# EAGLE design collidoscope_pcb (EAGLE 7.5.0)
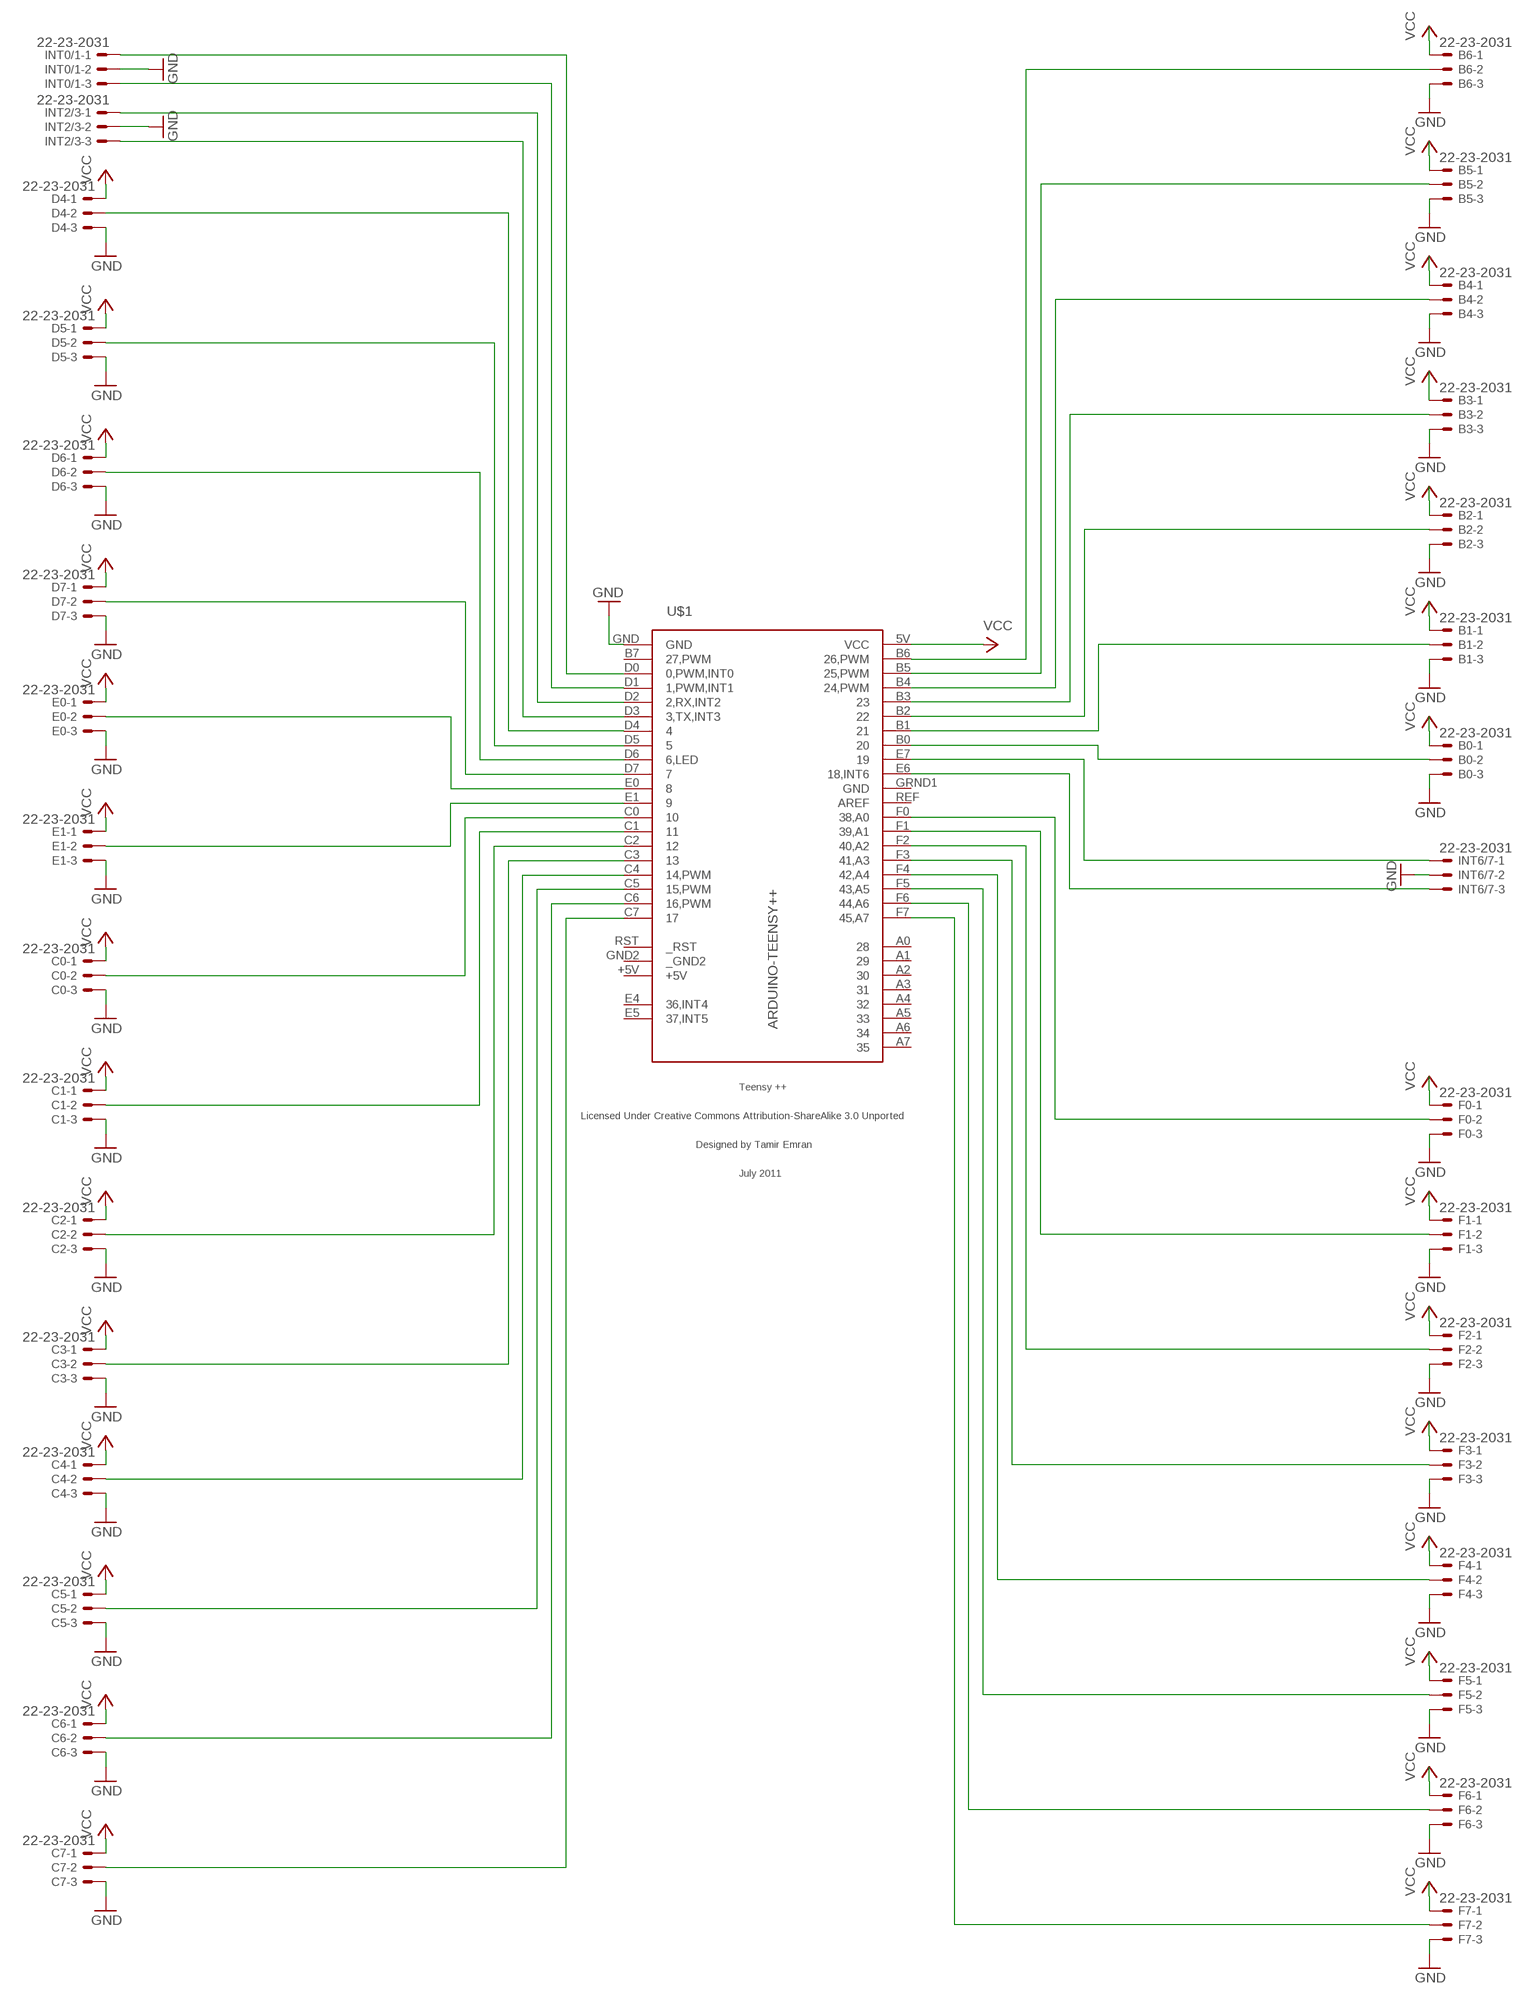
[diagram p0: schematic, sheet 1]

## Parts
B0  22-23-2031  [22-23-2031]
B1  22-23-2031  [22-23-2031]
B2  22-23-2031  [22-23-2031]
B3  22-23-2031  [22-23-2031]
B4  22-23-2031  [22-23-2031]
B5  22-23-2031  [22-23-2031]
B6  22-23-2031  [22-23-2031]
C0  22-23-2031  [22-23-2031]
C1  22-23-2031  [22-23-2031]
C2  22-23-2031  [22-23-2031]
C3  22-23-2031  [22-23-2031]
C4  22-23-2031  [22-23-2031]
C5  22-23-2031  [22-23-2031]
C6  22-23-2031  [22-23-2031]
C7  22-23-2031  [22-23-2031]
D4  22-23-2031  [22-23-2031]
D5  22-23-2031  [22-23-2031]
D6  22-23-2031  [22-23-2031]
D7  22-23-2031  [22-23-2031]
E0  22-23-2031  [22-23-2031]
E1  22-23-2031  [22-23-2031]
F0  22-23-2031  [22-23-2031]
F1  22-23-2031  [22-23-2031]
F2  22-23-2031  [22-23-2031]
F3  22-23-2031  [22-23-2031]
F4  22-23-2031  [22-23-2031]
F5  22-23-2031  [22-23-2031]
F6  22-23-2031  [22-23-2031]
F7  22-23-2031  [22-23-2031]
INT0/1  22-23-2031  [22-23-2031]
INT2/3  22-23-2031  [22-23-2031]
INT6/7  22-23-2031  [22-23-2031]
U$1  ARDUINO-TEENSY++  [TEENSY++]

## Nets
GND: B0.3 B1.3 B2.3 B3.3 B4.3 B5.3 B6.3 C0.3 C1.3 C2.3 C3.3 C4.3 C5.3 C6.3 C7.3 D4.3 D5.3 D6.3 D7.3 E0.3 E1.3 F0.3 F1.3 F2.3 F3.3 F4.3 F5.3 F6.3 F7.3 INT0/1.2 INT2/3.2 INT6/7.2 U$1.GND
N$1: B6.2 U$1.B6(26,PWM)
N$2: B5.2 U$1.B5(25,PWM)
N$3: B4.2 U$1.B4(24,PWM)
N$4: B3.2 U$1.B3
N$5: B2.2 U$1.B2
N$6: B1.2 U$1.B1
N$7: B0.2 U$1.B0
N$8: INT6/7.1 U$1.E7
N$9: INT6/7.3 U$1.E6(18,INT6)
N$10: F0.2 U$1.F0(38,A0)
N$11: F1.2 U$1.F1(39,A1)
N$12: F2.2 U$1.F2(40,A2)
N$13: F3.2 U$1.F3(41,A3)
N$14: F4.2 U$1.F4(42,A4)
N$15: F5.2 U$1.F5(43,A5)
N$16: F6.2 U$1.F6(44,A6)
N$17: F7.2 U$1.F7(45,A7)
N$18: INT0/1.1 U$1.D0(0,PWM,INT0)
N$19: INT0/1.3 U$1.D1(1,PWM,INT1)
N$20: INT2/3.1 U$1.D2(2,RX,INT2)
N$21: INT2/3.3 U$1.D3(3,TX,INT3)
N$22: D4.2 U$1.D4
N$23: D5.2 U$1.D5
N$24: D6.2 U$1.D6(6,LED)
N$25: D7.2 U$1.D7
N$26: E0.2 U$1.E0
N$27: E1.2 U$1.E1
N$28: C0.2 U$1.C0
N$29: C1.2 U$1.C1
N$30: C2.2 U$1.C2
N$31: C3.2 U$1.C3
N$32: C4.2 U$1.C4(14,PWM)
N$33: C5.2 U$1.C5(15,PWM)
N$34: C6.2 U$1.C6(16,PWM)
N$35: C7.2 U$1.C7
VCC: B0.1 B1.1 B2.1 B3.1 B4.1 B5.1 B6.1 C0.1 C1.1 C2.1 C3.1 C4.1 C5.1 C6.1 C7.1 D4.1 D5.1 D6.1 D7.1 E0.1 E1.1 F0.1 F1.1 F2.1 F3.1 F4.1 F5.1 F6.1 F7.1 U$1.5V(VCC)
Unconnected: U$1.A0 U$1.A1 U$1.A2 U$1.A3 U$1.A4 U$1.A5 U$1.A6 U$1.A7 U$1.B7(27,PWM) U$1.E4(36,INT4) U$1.E5(37,INT5) U$1.REF(AREF) U$1.RST(_RST)

## Power pins joined to a net without a drawn wire
+5V: U$1.+5V
_GND2: U$1.GND2(_GND2)
GND: U$1.GRND1(GND)

## Library data of the parts
B0 B1-B6 C0 C1-C7 D4-D7 E0 E1 F0 F1-F7 INT0/1 INT2/3 INT6/7 = con-molex:22-23-2031: .100" (2.54mm) Center Header - 3 Pin; MF: MOLEX; MPN: 22-23-2031; OC_FARNELL: 1462950; OC_NEWARK: 30C0862
U$1 = teensypp:ARDUINO-TEENSY++: Teensy ++ Original Design by Mark Gross Modified Design by Tamir Emran Licensed Under Creative Commons Attribution-ShareAlike 3.0 Unported (CC BY-SA 3.0)

## Net classes
0 default: width 0.305 mm, drill 0.508 mm, clearance 0.254 mm

## Board
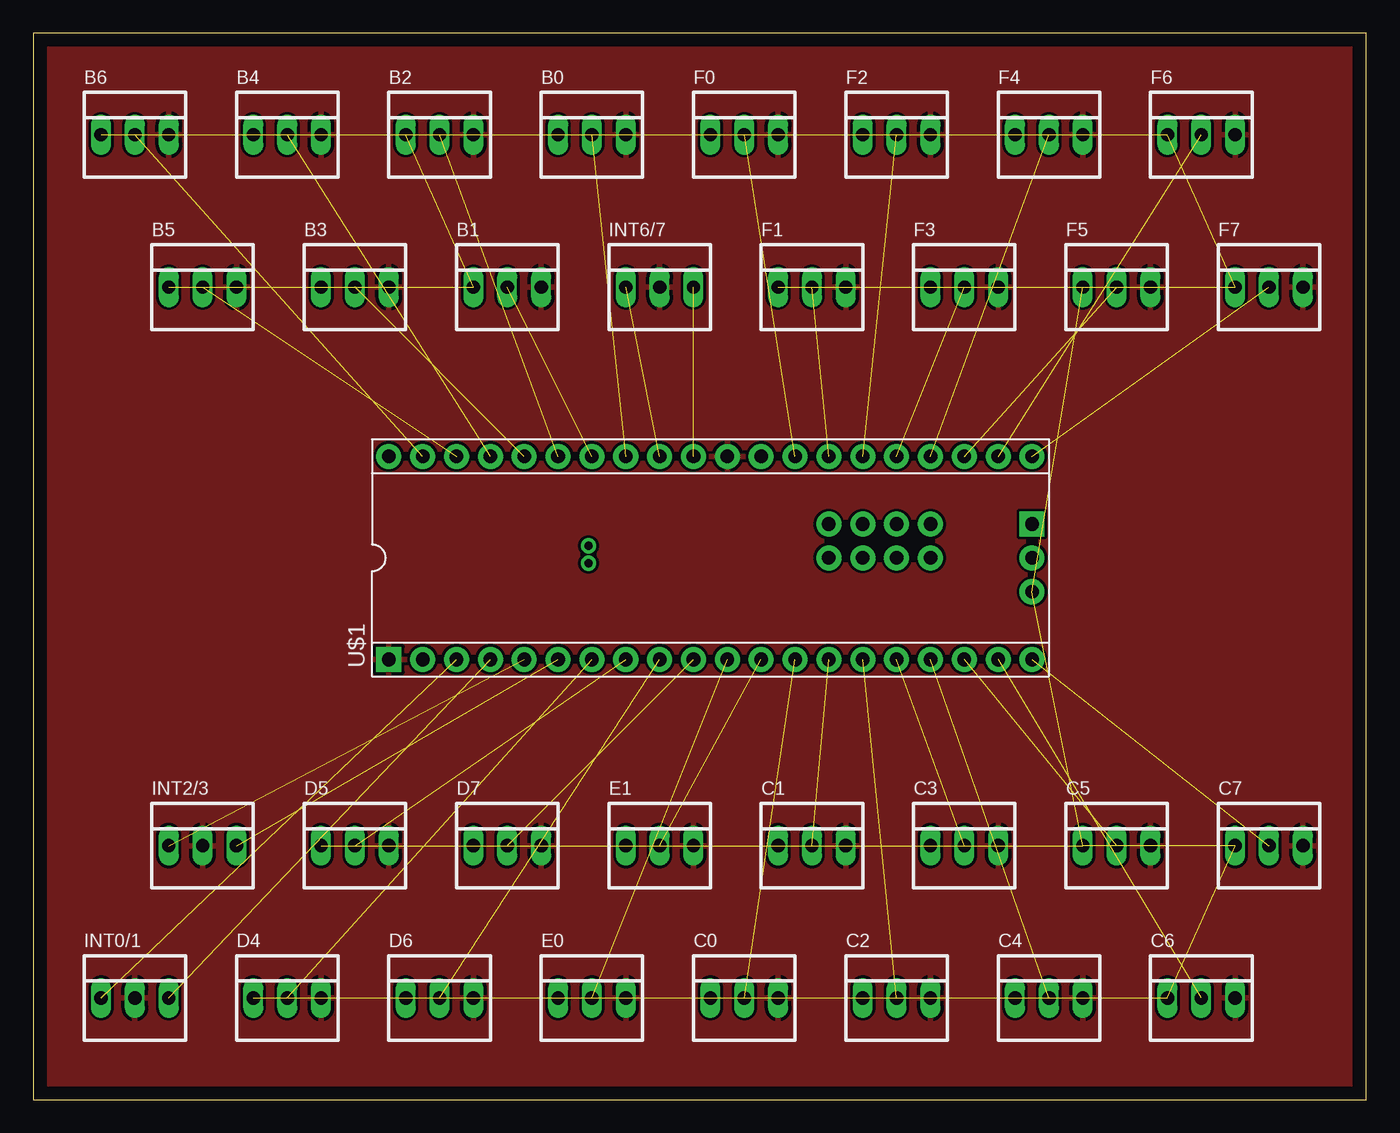
[diagram p1: board, top side]

Size 100 x 80 mm. Coordinates in mm from the lower left corner, seen from the top.
Outline: 0,0 100,0 100,80 0,80 0,0
Copper layers (1*16): Top 0.035mm / dielectric 1.5mm / Bottom 0.035mm
Design rules "default": minimum track width 10mil, minimum drill 24mil, track to track 8mil, track to pad 8mil, pad to pad 8mil, via to via 8mil, smd to smd 8mil, copper to edge 40mil, drill to drill 8mil, minimum pad ring 10mil, minimum via ring 8mil, stop-mask expansion 4mil, vias tented up to drill 0mil, thermal gap 10mil

### Footprints (pad centres in the part's own frame; a part is rotated, then mirrored left to right if it is on the bottom)
22-23-2031 = drill 1 long: 1 -2.54,0; 2 0,0; 3 2.54,0
TEENSY++ = drill 1.016 pad 1.88: 5V 24.13,-2.54; +5V -24.13,7.62; A0 8.89,0; A1 11.43,0; A2 13.97,0; A3 16.51,0; A4 8.89,2.54; A5 11.43,2.54; A6 13.97,2.54; A7 16.51,2.54; B0 -6.35,7.62; B1 -8.89,7.62; B2 -11.43,7.62; B3 -13.97,7.62; B4 -16.51,7.62; B5 -19.05,7.62; B6 -21.59,7.62; B7 -21.59,-7.62; C0 6.35,-7.62; C1 8.89,-7.62; C2 11.43,-7.62; C3 13.97,-7.62; C4 16.51,-7.62; C5 19.05,-7.62; C6 21.59,-7.62; C7 24.13,-7.62; D0 -19.05,-7.62; D1 -16.51,-7.62; D2 -13.97,-7.62; D3 -11.43,-7.62; D4 -8.89,-7.62; D5 -6.35,-7.62; D6 -3.81,-7.62; D7 -1.27,-7.62; E0 1.27,-7.62; E1 3.81,-7.62; E6 -1.27,7.62; E7 -3.81,7.62; F0 6.35,7.62; F1 8.89,7.62; F2 11.43,7.62; F3 13.97,7.62; F4 16.51,7.62; F5 19.05,7.62; F6 21.59,7.62; F7 24.13,7.62; GND2 24.13,0; GRND1 1.27,7.62; REF 3.81,7.62 | drill 0.635 pad 1.067: E4 -9.144,0.914; E5 -9.144,-0.406 | drill 1.016 pad 1.88 square: GND -24.13,-7.62; RST 24.13,2.54

### Placement (x,y rotation side)
B0  41.91,72.39 0 top
B1  35.56,60.96 0 top
B2  30.48,72.39 0 top
B3  24.13,60.96 0 top
B4  19.05,72.39 0 top
B5  12.7,60.96 0 top
B6  7.62,72.39 0 top
C0  53.34,7.62 0 top
C1  58.42,19.05 0 top
C2  64.77,7.62 0 top
C3  69.85,19.05 0 top
C4  76.2,7.62 0 top
C5  81.28,19.05 0 top
C6  87.63,7.62 0 top
C7  92.71,19.05 0 top
D4  19.05,7.62 0 top
D5  24.13,19.05 0 top
D6  30.48,7.62 0 top
D7  35.56,19.05 0 top
E0  41.91,7.62 0 top
E1  46.99,19.05 0 top
F0  53.34,72.39 0 top
F1  58.42,60.96 0 top
F2  64.77,72.39 0 top
F3  69.85,60.96 0 top
F4  76.2,72.39 0 top
F5  81.28,60.96 0 top
F6  87.63,72.39 0 top
F7  92.71,60.96 0 top
INT0/1  7.62,7.62 0 top
INT2/3  12.7,19.05 0 top
INT6/7  46.99,60.96 0 top
U$1  50.8,40.64 0 top

### Tracks (layer width: path | path; a pad name or v marks a point on that pad's centre or on a via)
GND
  pour Top: -2.54,83.82 102.87,83.82 102.87,82.55 102.87,-1.27 -2.54,-1.27
N$1  (1 unrouted)
N$2  (1 unrouted)
N$3  (1 unrouted)
N$4  (1 unrouted)
N$5  (1 unrouted)
N$6  (1 unrouted)
N$7  (1 unrouted)
N$8  (1 unrouted)
N$9  (1 unrouted)
N$10  (1 unrouted)
N$11  (1 unrouted)
N$12  (1 unrouted)
N$13  (1 unrouted)
N$14  (1 unrouted)
N$15  (1 unrouted)
N$16  (1 unrouted)
N$17  (1 unrouted)
N$18  (1 unrouted)
N$19  (1 unrouted)
N$20  (1 unrouted)
N$21  (1 unrouted)
N$22  (1 unrouted)
N$23  (1 unrouted)
N$24  (1 unrouted)
N$25  (1 unrouted)
N$26  (1 unrouted)
N$27  (1 unrouted)
N$28  (1 unrouted)
N$29  (1 unrouted)
N$30  (1 unrouted)
N$31  (1 unrouted)
N$32  (1 unrouted)
N$33  (1 unrouted)
N$34  (1 unrouted)
N$35  (1 unrouted)
VCC  (29 unrouted)